# Altium project CutMonitor.PrjPcb
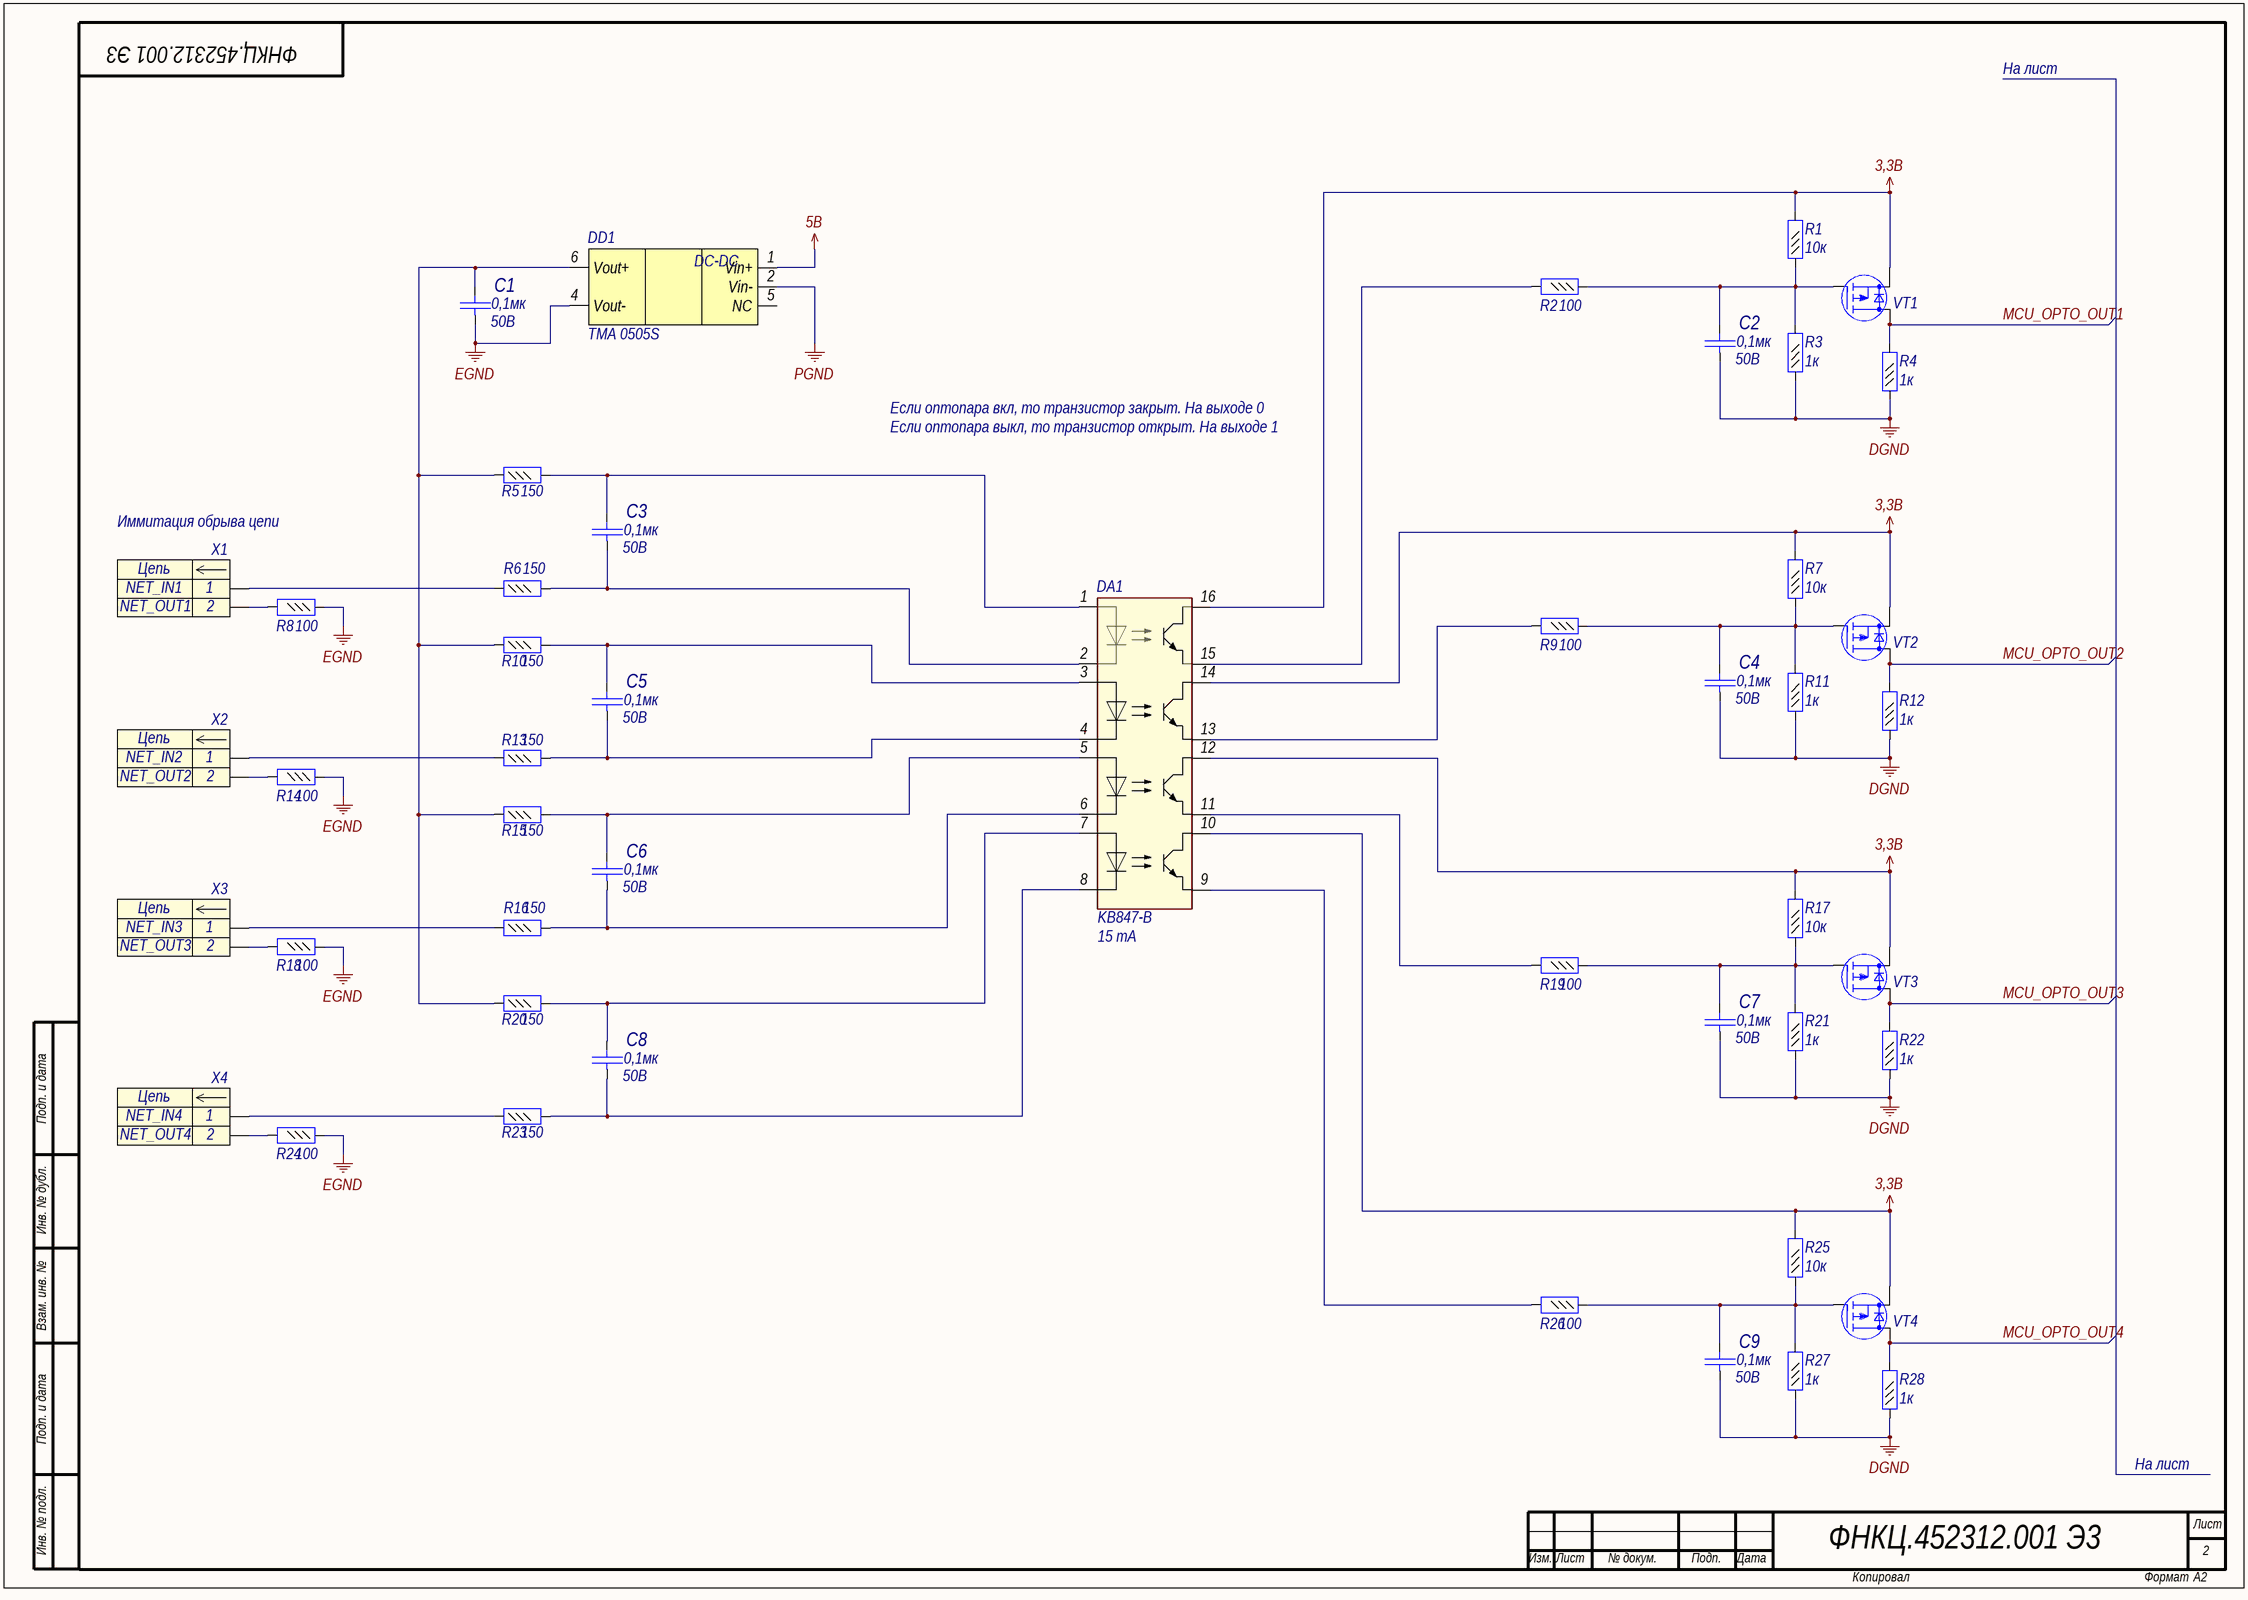
[diagram p0: CutMonitor_Opto.SchDoc]
5 sheets, 192 parts. Net scope: global (net labels, ports and power ports of the same name join across sheets).
Board file: CutMonitor.PcbDoc
Sheets:
  CutMonitor_Opto.SchDoc
  CutMonitor_MCU.SchDoc
  CutMonitor_Power.SchDoc
  CutMonitor_Motor.SchDoc
  CutMonitor_PressureSensor.SchDoc

## Sheet CutMonitor_Opto.SchDoc
size 594 x 420 mm; DocumentNumber: ФНКЦ.452312.001 Э3; SheetNumber: 2; Format: A2

### Parts
C1  value 0,1мк  Voltage: 50B  [C0603]  (hidden comment: Capacitor)
C2  value 0,1мк  Voltage: 50B  [C0603]  (hidden comment: Capacitor)
C3  value 0,1мк  Voltage: 50B  [C0603]  (hidden comment: Capacitor)
C4  value 0,1мк  Voltage: 50B  [C0603]  (hidden comment: Capacitor)
C5  value 0,1мк  Voltage: 50B  [C0603]  (hidden comment: Capacitor)
C6  value 0,1мк  Voltage: 50B  [C0603]  (hidden comment: Capacitor)
C7  value 0,1мк  Voltage: 50B  [C0603]  (hidden comment: Capacitor)
C8  value 0,1мк  Voltage: 50B  [C0603]  (hidden comment: Capacitor)
C9  value 0,1мк  Voltage: 50B  [C0603]  (hidden comment: Capacitor)
DA1  Part Number: KB847-B  [OPTO-16]  (hidden comment: OPTO-4)
DD1  Part Number: TMA 0505S  [TMH0505]  (hidden comment: TMA)
R1  value 10к  [R0603]  (hidden comment: Resistor_0,062Вт)
R2  value 100  [R0603]  (hidden comment: Resistor_0,062Вт)
R3  value 1к  [R0603]  (hidden comment: Resistor_0,062Вт)
R4  value 1к  [R0603]  (hidden comment: Resistor_0,062Вт)
R5  value 150  [R0603]  (hidden comment: Resistor_0,062Вт)
R6  value 150  [R0603]  (hidden comment: Resistor_0,062Вт)
R7  value 10к  [R0603]  (hidden comment: Resistor_0,062Вт)
R8  value 100  [R0603]  (hidden comment: Resistor_0,062Вт)
R9  value 100  [R0603]  (hidden comment: Resistor_0,062Вт)
R10  value 150  [R0603]  (hidden comment: Resistor_0,062Вт)
R11  value 1к  [R0603]  (hidden comment: Resistor_0,062Вт)
R12  value 1к  [R0603]  (hidden comment: Resistor_0,062Вт)
R13  value 150  [R0603]  (hidden comment: Resistor_0,062Вт)
R14  value 100  [R0603]  (hidden comment: Resistor_0,062Вт)
R15  value 150  [R0603]  (hidden comment: Resistor_0,062Вт)
R16  value 150  [R0603]  (hidden comment: Resistor_0,062Вт)
R17  value 10к  [R0603]  (hidden comment: Resistor_0,062Вт)
R18  value 100  [R0603]  (hidden comment: Resistor_0,062Вт)
R19  value 100  [R0603]  (hidden comment: Resistor_0,062Вт)
R20  value 150  [R0603]  (hidden comment: Resistor_0,062Вт)
R21  value 1к  [R0603]  (hidden comment: Resistor_0,062Вт)
R22  value 1к  [R0603]  (hidden comment: Resistor_0,062Вт)
R23  value 150  [R0603]  (hidden comment: Resistor_0,062Вт)
R24  value 100  [R0603]  (hidden comment: Resistor_0,062Вт)
R25  value 10к  [R0603]  (hidden comment: Resistor_0,062Вт)
R26  value 100  [R0603]  (hidden comment: Resistor_0,062Вт)
R27  value 1к  [R0603]  (hidden comment: Resistor_0,062Вт)
R28  value 1к  [R0603]  (hidden comment: Resistor_0,062Вт)
VT1  P-MOSFET  [SOT23-3]  (value not drawn)
VT2  P-MOSFET  [SOT23-3]  (value not drawn)
VT3  P-MOSFET  [SOT23-3]  (value not drawn)
VT4  P-MOSFET  [SOT23-3]  (value not drawn)
X1  (no value)  [JUMPER_2.54]
X2  (no value)  [JUMPER_2.54]
X3  (no value)  [JUMPER_2.54]
X4  (no value)  [JUMPER_2.54]

### Nets
3,3В: DA1.10 DA1.12 DA1.14 DA1.16 R1.2 R7.2 R17.2 R25.2 VT1.3(S) VT2.3(S) VT3.3(S) VT4.3(S)
5В: DD1.1(Vin+)
DGND: C2.1 C4.1 C7.1 C9.1 R3.1 R4.1 R11.1 R12.1 R21.1 R22.1 R27.1 R28.1
EGND: C1.1 DD1.4(Vout-) R8.1 R14.1 R18.1 R24.1
PGND: DD1.2(Vin-)
MCU_OPTO_OUT1: R4.2 VT1.2(D)
MCU_OPTO_OUT2: R12.2 VT2.2(D)
MCU_OPTO_OUT3: R22.2 VT3.2(D)
MCU_OPTO_OUT4: R28.2 VT4.2(D)
NetC1_2: C1.2 DD1.6(Vout+) R5.1 R10.1 R15.1 R20.1
NetC2_2: C2.2 R1.1 R2.1 R3.2 VT1.1(G)
NetC3_1: C3.1 DA1.2 R6.2
NetC3_2: C3.2 DA1.1 R5.2
NetC4_2: C4.2 R7.1 R9.1 R11.2 VT2.1(G)
NetC5_1: C5.1 DA1.4 R13.2
NetC5_2: C5.2 DA1.3 R10.2
NetC6_1: C6.1 DA1.6 R16.2
NetC6_2: C6.2 DA1.5 R15.2
NetC7_2: C7.2 R17.1 R19.1 R21.2 VT3.1(G)
NetC8_1: C8.1 DA1.8 R23.2
NetC8_2: C8.2 DA1.7 R20.2
NetC9_2: C9.2 R25.1 R26.1 R27.2 VT4.1(G)
NetDA1_9: DA1.9 R26.2
NetDA1_11: DA1.11 R19.2
NetDA1_13: DA1.13 R9.2
NetDA1_15: DA1.15 R2.2
NetR6_1: R6.1 X1.1
NetR8_2: R8.2 X1.2
NetR13_1: R13.1 X2.1
NetR14_2: R14.2 X2.2
NetR16_1: R16.1 X3.1
NetR18_2: R18.2 X3.2
NetR23_1: R23.1 X4.1
NetR24_2: R24.2 X4.2

Not connected (* = marked no-connect by the designer): DD1 5(NC)

### Notes on the sheet
- На лист
- Если оптопара вкл, то транзистор закрыт. На выходе 0
- Если оптопара выкл, то транзистор открыт. На выходе 1
- Иммитация обрыва цепи
- (near DA1) 15 mA
- Подп. и дата
- Инв. № дубл.
- Взам. инв. №
- Инв. № подл.
- Лист
- Изм.
- № докум.
- Подп.
- Дата
- Копировал
- Формат
- (in symbol connect54) Цепь
- (in symbol pwr22) DC-DC

### Library data of the parts
C1-C9 = cap131: Конденсатор; Part Name: Ceramic; Manufacture: Murata; Part Number: GRM188R71H104KA93D; id: cap131; TKE: X7R
DA1 = KB847-B: Опторазвязка х4; Manufacturer: Kingbright; id: opto1; Cut-off frequency: 80kHz; Forward Voltage: 1,2B
DD1 = pwr22: DC/DC преобразователь; Part Name: DC/DC Converter Isolated; Manufacturer: Traco Power; id: pwr22; Input Voltage: 5B; Current: 200mA; Type: Isolated; Output Voltage: 5B
R1 R7 R17 R25 = res483: Резистор; Manufacture: Yageo; Part Number: RC0603FR-0710KL; id: res483; Accuracy: 0,01; Part Name: Resistor; Power: 0,062Вт
R2 R8 R9 R14 R18 R19 R24 R26 = res435: Резистор; Manufacture: Yageo; Part Number: RC0603FR-07100RL; id: res435; Accuracy: 0,01; Part Name: Resistor; Power: 0,062Вт
R3 R4 R11 R12 R21 R22 R27 R28 = res459: Резистор; Manufacture: Yageo; Part Number: RC0603FR-071KL; id: res459; Accuracy: 0,01; Part Name: Resistor; Power: 0,062Вт
R5 R6 R10 R13 R15 R16 R20 R23 = res439: Резистор; Manufacture: Yageo; Part Number: RC0603FR-07150RL; id: res439; Accuracy: 0,01; Part Name: Resistor; Power: 0,062Вт
VT1-VT4 = mosfert5: N-MOSFET; Part Number: IRLML2244TRPbF; Manufacturer: International Rectifier; Structure: p-channel; V drain-source max: (-20B); Rds: 0,054Ohm; Gate-to-source voltage: (+-)12B; Continuous drain current: (-4,3)A; Total gate charge: 6,9nC; Pulsed drain current: (-18)A; Power dissipation: 1,3W; id: mosfert5
X1 = connect54: Разъем - 2 конт. вилка; Part Name: Jumper 2,54mm; Contact_1: NET_IN1; Contact_2: NET_OUT1; Etch: 2,54mm; id: connect54
X2 = connect54: Разъем - 2 конт. вилка; Part Name: Jumper 2,54mm; Contact_1: NET_IN2; Contact_2: NET_OUT2; Etch: 2,54mm; id: connect54
X3 = connect54: Разъем - 2 конт. вилка; Part Name: Jumper 2,54mm; Contact_1: NET_IN3; Contact_2: NET_OUT3; Etch: 2,54mm; id: connect54
X4 = connect54: Разъем - 2 конт. вилка; Part Name: Jumper 2,54mm; Contact_1: NET_IN4; Contact_2: NET_OUT4; Etch: 2,54mm; id: connect54

## Sheet CutMonitor_MCU.SchDoc
size 594 x 420 mm; DocumentNumber: ФНКЦ.452312.001 Э3; SheetNumber: 2; Format: A2
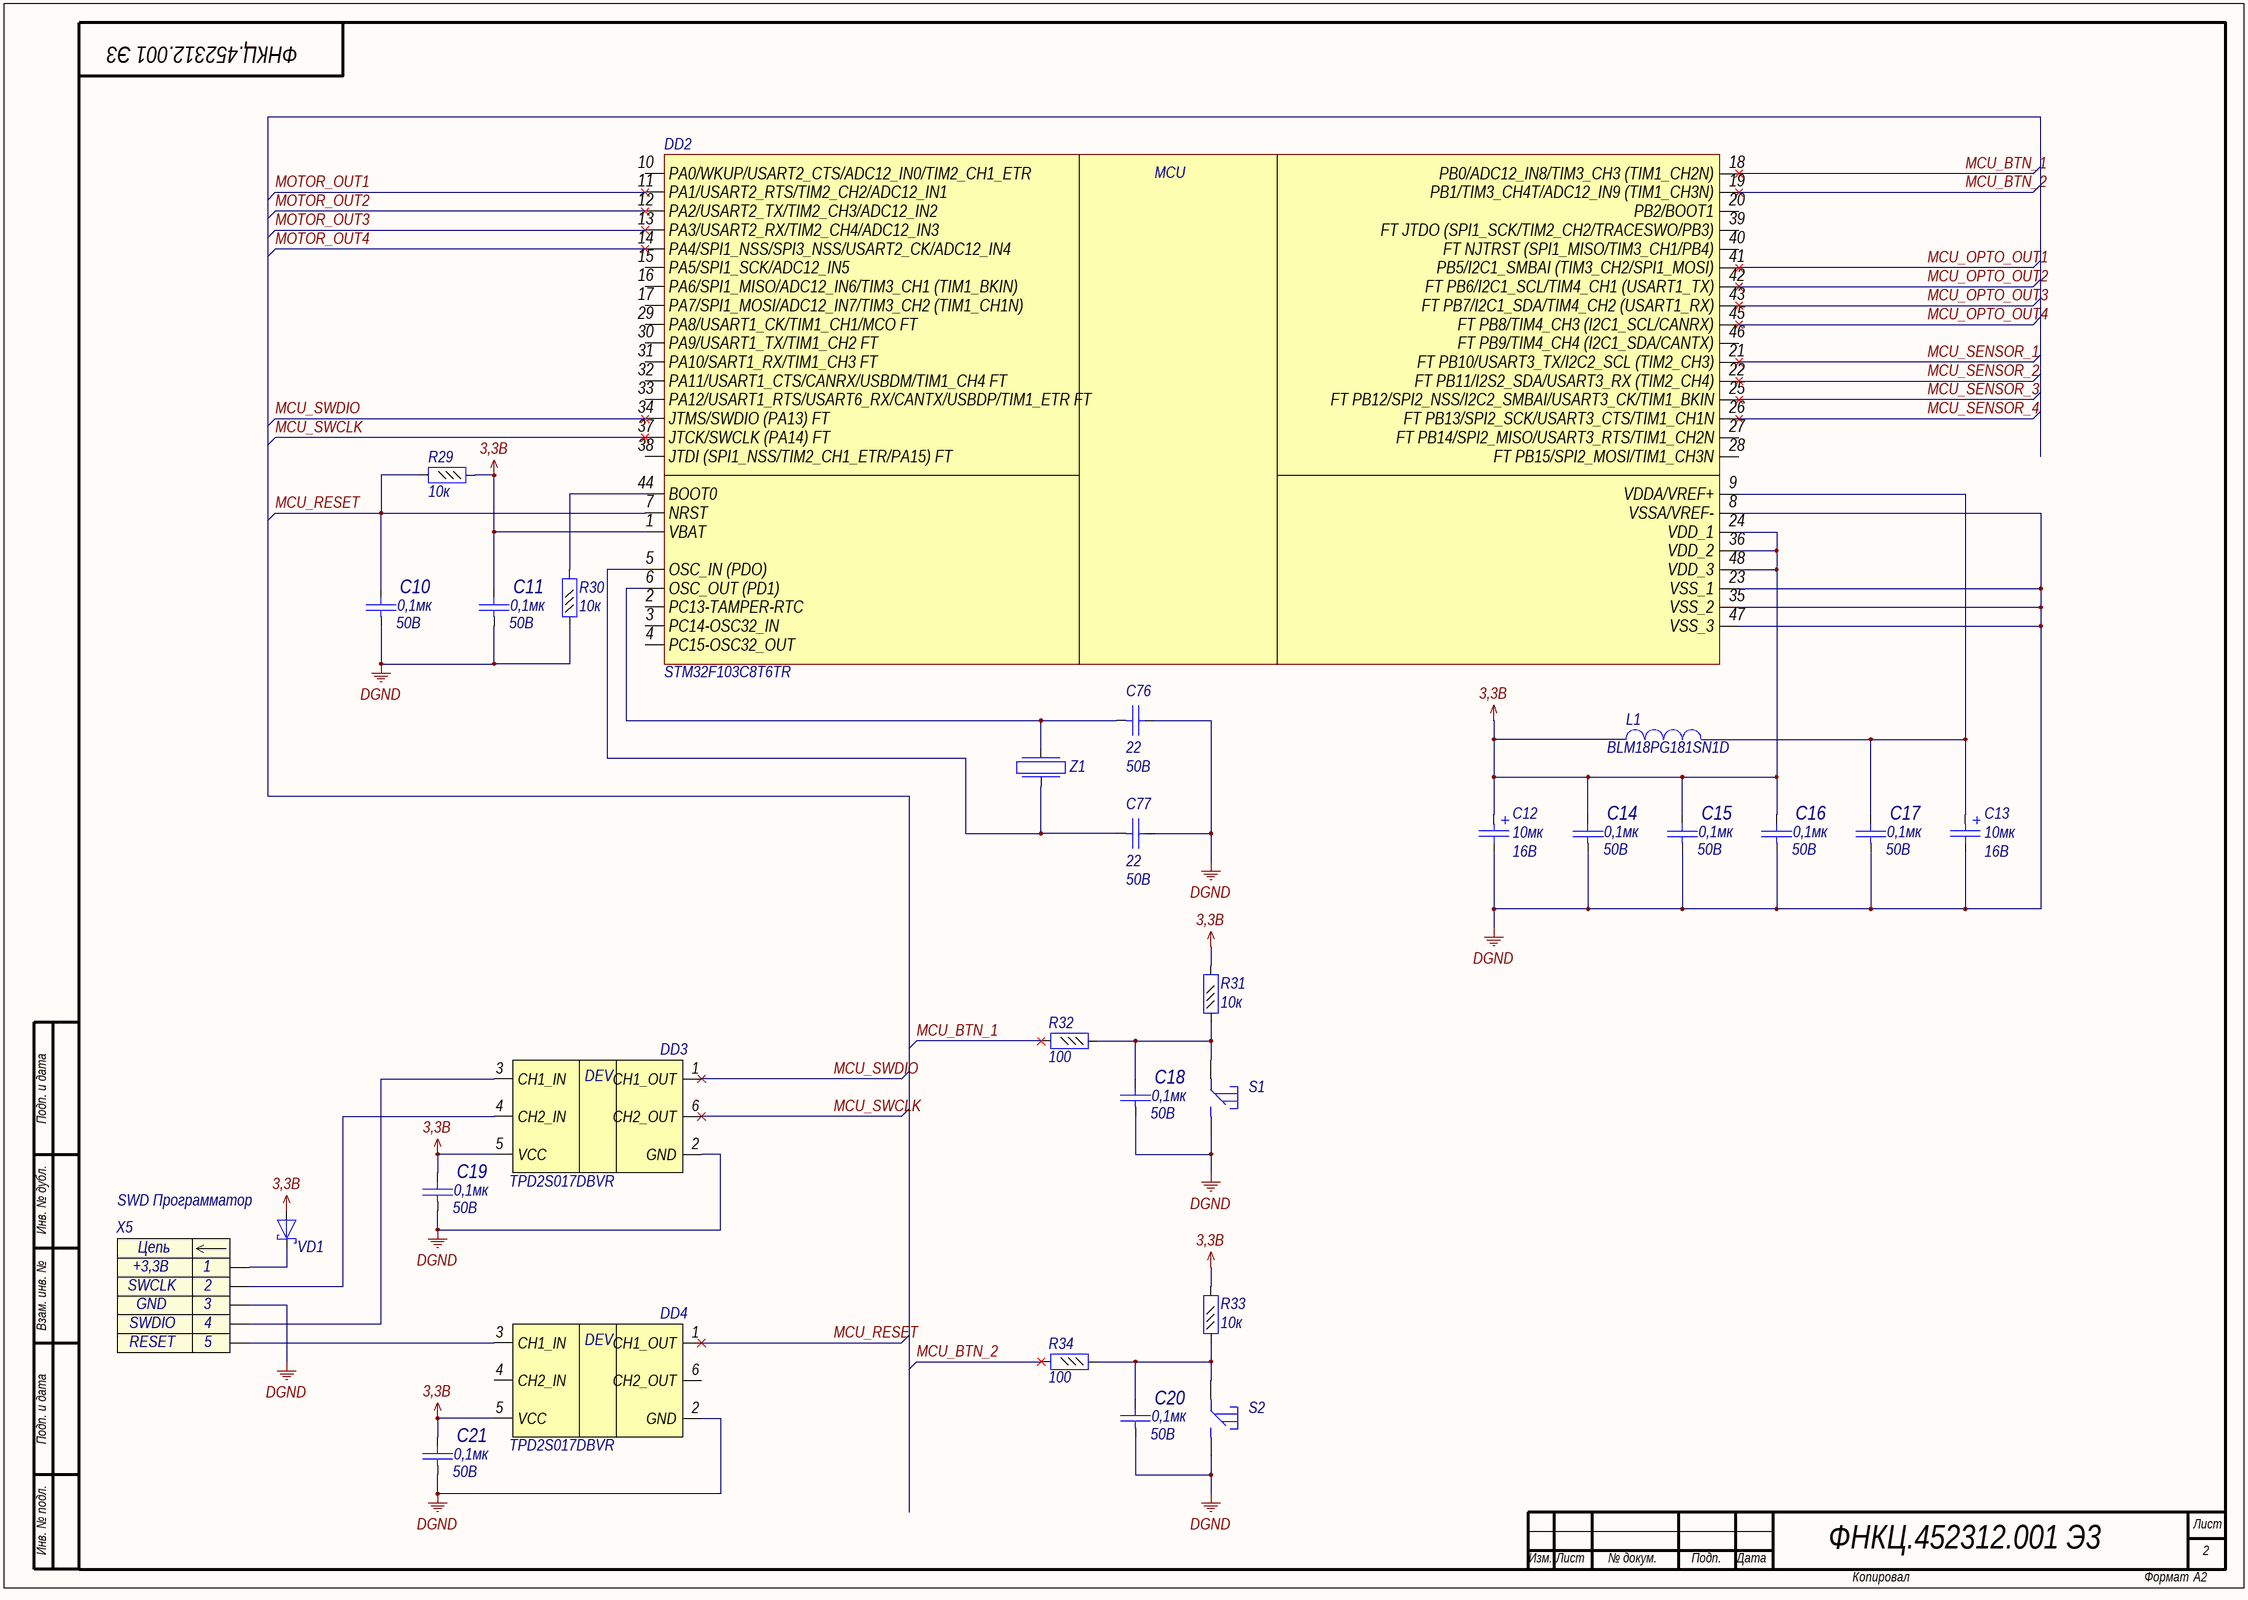
[diagram p1: CutMonitor_MCU.SchDoc]

### Parts
C10  value 0,1мк  Voltage: 50B  [C0603]  (hidden comment: Capacitor)
C11  value 0,1мк  Voltage: 50B  [C0603]  (hidden comment: Capacitor)
C12  value 10мк  Voltage: 16В  [TANTAL CASE A]  (hidden comment: Capacitor_pol)
C13  value 10мк  Voltage: 16В  [TANTAL CASE A]  (hidden comment: Capacitor_pol)
C14  value 0,1мк  Voltage: 50B  [C0603]  (hidden comment: Capacitor)
C15  value 0,1мк  Voltage: 50B  [C0603]  (hidden comment: Capacitor)
C16  value 0,1мк  Voltage: 50B  [C0603]  (hidden comment: Capacitor)
C17  value 0,1мк  Voltage: 50B  [C0603]  (hidden comment: Capacitor)
C18  value 0,1мк  Voltage: 50B  [C0603]  (hidden comment: Capacitor)
C19  value 0,1мк  Voltage: 50B  [C0603]  (hidden comment: Capacitor)
C20  value 0,1мк  Voltage: 50B  [C0603]  (hidden comment: Capacitor)
C21  value 0,1мк  Voltage: 50B  [C0603]  (hidden comment: Capacitor)
C76  value 22  Voltage: 50B  [C0603]  (hidden comment: Capacitor)
C77  value 22  Voltage: 50B  [C0603]  (hidden comment: Capacitor)
DD2  STM32F103C8T6TR  [LQFP48]
DD3  Part Number: TPD2S017DBVR  [SOT23-6]  (hidden comment: TPD2S017)
DD4  Part Number: TPD2S017DBVR  [SOT23-6]  (hidden comment: TPD2S017)
L1  Part Number: BLM18PG181SN1D  [L0603]  (hidden comment: Inductor)
R29  value 10к  [R0603]  (hidden comment: Resistor_0,062Вт)
R30  value 10к  [R0603]  (hidden comment: Resistor_0,062Вт)
R31  value 10к  [R0603]  (hidden comment: Resistor_0,062Вт)
R32  value 100  [R0603]  (hidden comment: Resistor_0,062Вт)
R33  value 10к  [R0603]  (hidden comment: Resistor_0,062Вт)
R34  value 100  [R0603]  (hidden comment: Resistor_0,062Вт)
S1  Button  [Button_SMD]  (value not drawn)
S2  Button  [Button_SMD]  (value not drawn)
VD1  DiodeSchottky  [SOD-523]  (value not drawn)
X5  SWD Программатор  [PLS-5]
Z1  Crystal  [QSMD5.0x3.2x1.0]  (value not drawn)

### Nets
3,3B: C11.2 C12.1 C14.2 C15.2 C16.2 C19.2 C21.2 DD2.1(VBAT) DD2.24(VDD_1) DD2.36(VDD_2) DD2.48(VDD_3) DD3.5(VCC) DD4.5(VCC) L1.1 R29.1 R31.2 R33.2 VD1.2(A)
DGND: C10.1 C11.1 C12.2 C13.2 C14.1 C15.1 C16.1 C17.1 C18.1 C19.1 C20.1 C21.1 C76.2 C77.2 DD2.8(VSSA/VREF-) DD2.23(VSS_1) DD2.35(VSS_2) DD2.47(VSS_3) DD3.2(GND) DD4.2(GND) R30.1 S1.4 S2.4 X5.3
MCU_BTN_1: DD2.18(PB0/ADC12_IN8/TIM3_CH3_(TIM1_CH2N)) R32.2
MCU_BTN_2: DD2.19(PB1/TIM3_CH4T/ADC12_IN9_(TIM1_CH3N)) R34.2
MCU_OPTO_OUT1: DD2.41(PB5/I2C1_SMBAI_(TIM3_CH2/SPI1_MOSI))
MCU_OPTO_OUT2: DD2.42(FT_PB6/I2C1_SCL/TIM4_CH1_(USART1_TX))
MCU_OPTO_OUT3: DD2.43(FT_PB7/I2C1_SDA/TIM4_CH2_(USART1_RX))
MCU_OPTO_OUT4: DD2.45(FT_PB8/TIM4_CH3_(I2C1_SCL/CANRX))
MCU_RESET: C10.2 DD2.7(NRST) DD4.1(CH1_OUT) R29.2
MCU_SENSOR_1: DD2.21(FT_PB10/USART3_TX/I2C2_SCL_(TIM2_CH3))
MCU_SENSOR_2: DD2.22(FT_PB11/I2S2_SDA/USART3_RX_(TIM2_CH4))
MCU_SENSOR_3: DD2.25(FT_PB12/SPI2_NSS/I2C2_SMBAI/USART3_CK/TIM1_BKIN)
MCU_SENSOR_4: DD2.26(FT_PB13/SPI2_SCK/USART3_CTS/TIM1_CH1N)
MCU_SWCLK: DD2.37(JTCK/SWCLK_(PA14)_FT) DD3.6(CH2_OUT)
MCU_SWDIO: DD2.34(JTMS/SWDIO_(PA13)_FT) DD3.1(CH1_OUT)
MOTOR_OUT1: DD2.11(PA1/USART2_RTS/TIM2_CH2/ADC12_IN1)
MOTOR_OUT2: DD2.12(PA2/USART2_TX/TIM2_CH3/ADC12_IN2)
MOTOR_OUT3: DD2.13(PA3/USART2_RX/TIM2_CH4/ADC12_IN3)
MOTOR_OUT4: DD2.14(PA4/SPI1_NSS/SPI3_NSS/USART2_CK/ADC12_IN4)
NetC13_1: C13.1 C17.2 DD2.9(VDDA/VREF+) L1.2
NetC18_2: C18.2 R31.1 R32.1 S1.1
NetC20_2: C20.2 R33.1 R34.1 S2.1
NetC76_1: C76.1 DD2.6(OSC_OUT_(PD1)) Z1.2
NetC77_1: C77.1 DD2.5(OSC_IN_(PDO)) Z1.1
NetDD2_44: DD2.44(BOOT0) R30.2
NetDD3_3: DD3.3(CH1_IN) X5.4
NetDD3_4: DD3.4(CH2_IN) X5.2
NetDD4_3: DD4.3(CH1_IN) X5.5
NetVD1_1: VD1.1(K) X5.1

Not connected (* = marked no-connect by the designer): DD2 2(PC13-TAMPER-RTC) 3(PC14-OSC32_IN) 4(PC15-OSC32_OUT) 10(PA0/WKUP/USART2_CTS/ADC12_IN0/TIM2_CH1_ETR) 15(PA5/SPI1_SCK/ADC12_IN5) 16(PA6/SPI1_MISO/ADC12_IN6/TIM3_CH1_(TIM1_BKIN)) 17(PA7/SPI1_MOSI/ADC12_IN7/TIM3_CH2_(TIM1_CH1N)) 20(PB2/BOOT1) 27(FT_PB14/SPI2_MISO/USART3_RTS/TIM1_CH2N) 28(FT_PB15/SPI2_MOSI/TIM1_CH3N) 29(PA8/USART1_CK/TIM1_CH1/MCO_FT) 30(PA9/USART1_TX/TIM1_CH2_FT) 31(PA10/SART1_RX/TIM1_CH3_FT) 32(PA11/USART1_CTS/CANRX/USBDM/TIM1_CH4_FT) 33(PA12/USART1_RTS/USART6_RX/CANTX/USBDP/TIM1_ETR_FT) 38(JTDI_(SPI1_NSS/TIM2_CH1_ETR/PA15)_FT) 39(FT_JTDO_(SPI1_SCK/TIM2_CH2/TRACESWO/PB3)) 40(FT_NJTRST_(SPI1_MISO/TIM3_CH1/PB4)) 46(FT_PB9/TIM4_CH4_(I2C1_SDA/CANTX)); DD4 4(CH2_IN) 6(CH2_OUT)

### Notes on the sheet
- Подп. и дата
- Инв. № дубл.
- Взам. инв. №
- Инв. № подл.
- Лист
- Изм.
- № докум.
- Подп.
- Дата
- Копировал
- Формат
- (in symbol connect6) Цепь
- (in symbol microcont0) MСU
- (in symbol TPD2S017DBVR) DEV

### Library data of the parts
C10 C11 C14-C21 = cap131: as C1 on sheet CutMonitor_Opto
C12 C13 = cap199: Конденсатор полярный; Part Name: Tantal; Manufacture: Vishay; Part Number: 293D106X9016A2TE3; id: cap199
C76 C77 = cap77: Конденсатор; Part Name: Ceramic; Manufacture: Yageo; Part Number: CC0603JRNPO9BN220; id: cap77; TKE: NP0
DD2 = microcont0: Medium-density performance line ARM®-based 32-bit MCU with 64  or 128 KB Flash, USB, CAN, 7 timers, 2 ADCs, 9 com. interfaces; Part Name: Microcontroller; Frequency: 72MHz; ADC: 10x12b; Interface: can, i2c, irda, lin, spi, uart, usb; Flash: 64kb; Pin in: 37; Power Supply: 2.0-3.6 V; id: microcont0; Part Number: STM32F103C8T6TR
DD3 DD4 = TPD2S017DBVR: EMI Filter; Part Name: ESD Suppressors; Manufacture: Texas Instruments; id: esd4; Max Reverse Voltage: 12B; Capacitance: 1pF; Number of Channels: 2
L1 = ind0: EMI Suppression Filter; Part Name: EMI Suppression Filters; Rated Current: 1,5A; id: ind0; Resistance: 0,09Ohm
R29-R31 R33 = res483: as R1 on sheet CutMonitor_Opto; Part Name: Resistor; Power: 0,062Вт
R32 R34 = res435: as R2 on sheet CutMonitor_Opto; Part Name: Resistor; Power: 0,062Вт
S1 S2 = btn4: Кнопка; Part Name: Button 5mm; id: btn4
VD1 = diode12: Диод Шоттки; Part Number: PMEG2010AEB.115; Manufacture: NXP Semiconductor; Max Reverse Voltage: 20B; Forward Voltage: 0,62B; Forward Current: 1А; Breakdown Current: 600uA; Capacitance: 25pF; Number of Channels: 1; id: diode12; Part Name: Diode Schottky
X5 = connect6: Разъем - 5 конт. вилка; Part Number: DS1021-1*5SF112-B; Manufacture: Ningbo connfly electronic; Contact_1: +3,3B; Contact_2: SWCLK; Contact_3: GND; Contact_4: SWDIO; Contact_5: RESET; Etch: 2,54mm; Part Name: PLS-5; id: connect6
Z1 = crystal0: Кварцевый резонатор; Manufacture: GEYER; Part Number: KX-9A; Frequence: 8MHz; id: crystal0

## Sheet CutMonitor_Power.SchDoc: Аудиопередатчик
size 420 x 297 mm; ApprovedBy: Чукалкин; CheckedBy: Суворов; DrawnBy: Подлесный; DocumentNumber: ФНКЦ.542321.001 Э3; SheetNumber: 1; SheetTotal: 5; DocumentType: Схема электрическая принципиальная; Format: A3; ImagePath: ФНКЦ.542321.001
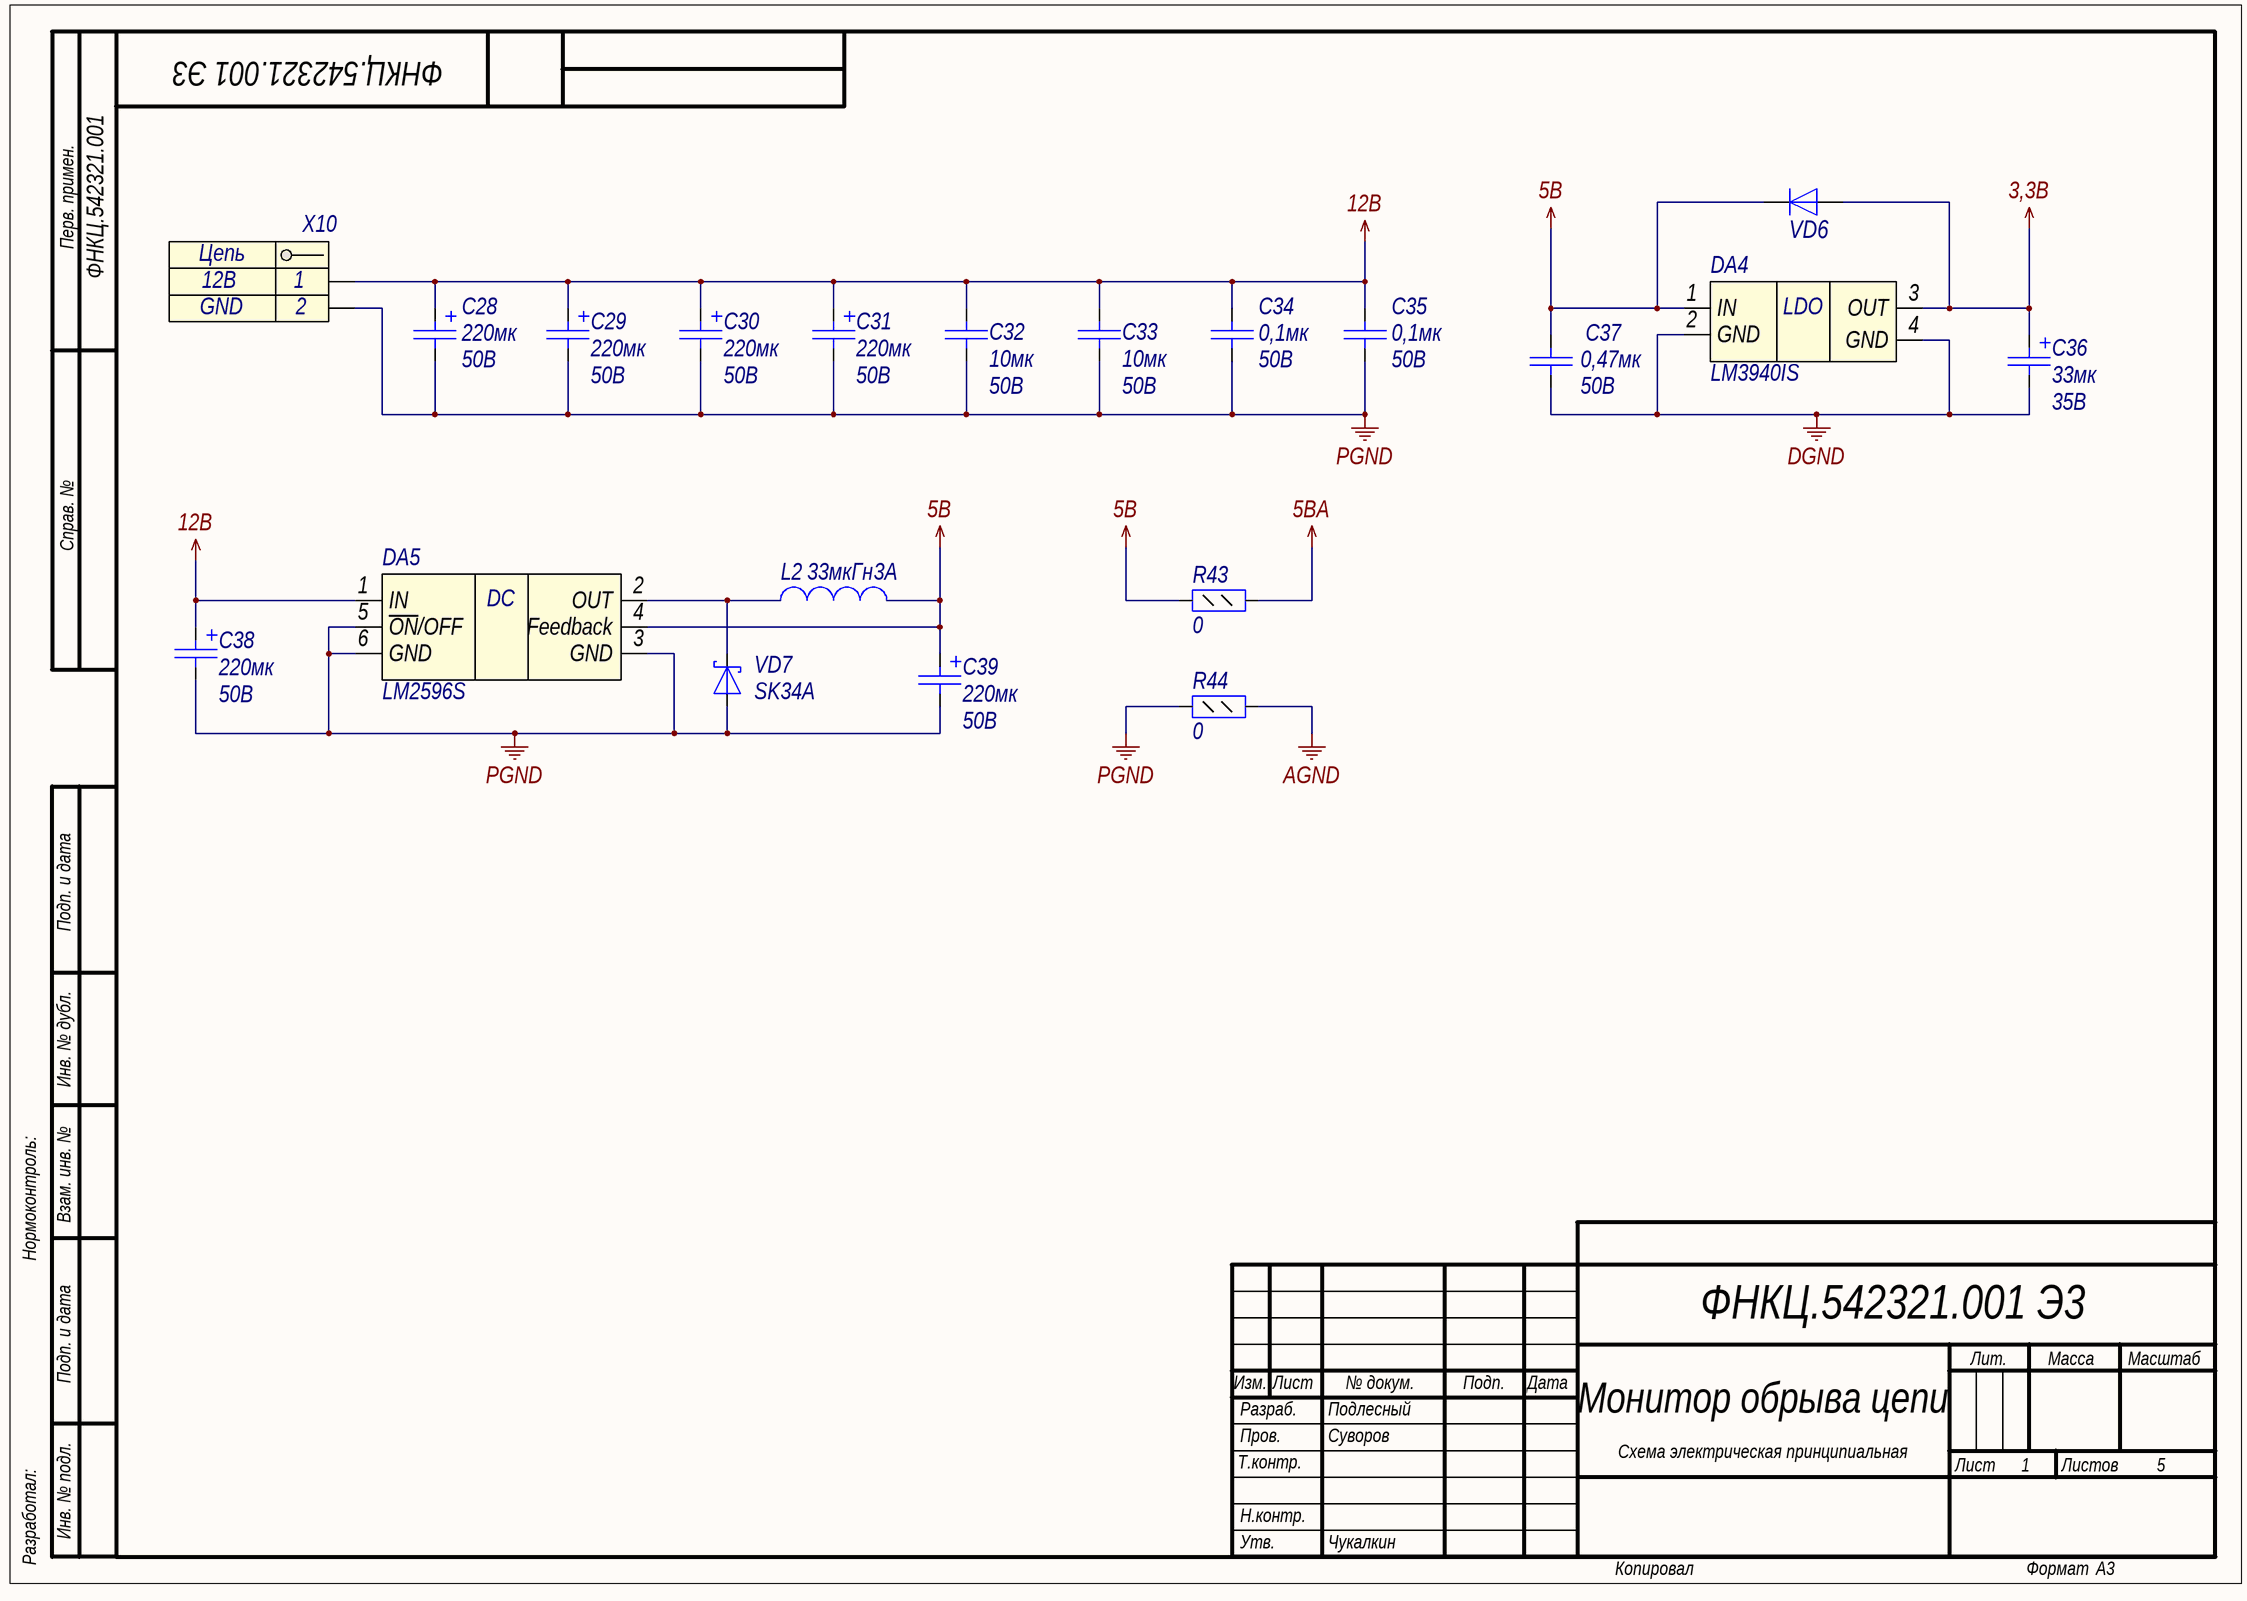
[diagram p2: CutMonitor_Power.SchDoc]

### Parts
C28  value 220мк  Voltage: 50В  [K50-35(10X12.5)]  (hidden comment: Capacitor_pol)
C29  value 220мк  Voltage: 50В  [K50-35(10X12.5)]  (hidden comment: Capacitor_pol)
C30  value 220мк  Voltage: 50В  [K50-35(10X12.5)_MIRROR]  (hidden comment: Capacitor_pol)
C31  value 220мк  Voltage: 50В  [K50-35(10X12.5)_MIRROR]  (hidden comment: Capacitor_pol)
C32  value 10мк  Voltage: 50В  [C1210]  (hidden comment: Capacitor)
C33  value 10мк  Voltage: 50В  [C1210]  (hidden comment: Capacitor)
C34  value 0,1мк  Voltage: 50В  [C1206]  (hidden comment: Capacitor)
C35  value 0,1мк  Voltage: 50В  [C1206]  (hidden comment: Capacitor)
C36  value 33мк  Voltage: 35В  [TANTAL CASE D]  (hidden comment: Capacitor_pol)
C37  value 0,47мк  Voltage: 50В  [C1206]  (hidden comment: Capacitor)
C38  value 220мк  Voltage: 50В  [K50-35(10X12.5)_MIRROR]  (hidden comment: Capacitor_pol)
C39  value 220мк  Voltage: 50В  [K50-35(10X12.5)_MIRROR]  (hidden comment: Capacitor_pol)
DA4  LM3940IS  [TO-263-3]
DA5  LM2596S  [TO-263-5]
L2  value 33мкГн  Rated Current: 3A  [IND_12.8x12.8]  (hidden comment: Inductor)
R43  value 0  [R0805]  (hidden comment: Resistor_0,125Вт)
R44  value 0  [R0805]  (hidden comment: Resistor_0,125Вт)
VD6  Diode  [SOD-523]  (value not drawn)
VD7  Part Number: SK34A  [SMA]  (hidden comment: DiodeSchottky)
X10  Header_2_trm  [TERMINAL-2WAY-5MM]  (value not drawn)

### Nets
3,3B: C36.1 DA4.3(OUT) VD6.2(A)
5B: C37.2 C39.1 DA4.1(IN) DA5.4(Feedback) L2.2 R43.1 VD6.1(K)
5BA: R43.2
12B: C28.1 C29.1 C30.1 C31.1 C32.1 C33.1 C34.1 C35.1 C38.1 DA5.1(IN) X10.1
AGND: R44.2
DGND: C36.2 C37.1 DA4.2(GND) DA4.4(GND)
PGND: C28.2 C29.2 C30.2 C31.2 C32.2 C33.2 C34.2 C35.2 C38.2 C39.2 DA5.3(GND) DA5.5(~{ON}/OFF) DA5.6(GND) R44.1 VD7.2(A) X10.2
NetDA5_2: DA5.2(OUT) L2.1 VD7.1(K)

### Notes on the sheet
- Перв. примен.
- Справ. №
- Подп. и дата
- Инв. № дубл.
- Нормоконтроль:
- Взам. инв. №
- Изм.
- Лист
- № докум.
- Подп.
- Дата
- Лит.
- Масса
- Масштаб
- Т.контр.
- Пров.
- Разраб.
- Монитор обрыва цепи
- Листов
- Разработал:
- Инв. № подл.
- Н.контр.
- Утв.
- Копировал
- Формат
- (in symbol connect21) Цепь
- (in symbol pwr0) LDO
- (in symbol pwr3) DC

### Library data of the parts
C28 C29 = cap219: Конденсатор полярный; Part Name: Electrolit; Manufacture: Jamicon; Part Number: TKR221M1HG13; id: cap219; tga: 0.20%
C30 C31 C38 C39 = cap220: Конденсатор полярный; Part Name: Electrolit; Manufacture: Jamicon; Part Number: TKR221M1HG13; id: cap220; tga: 0.20%
C32 C33 = cap206: Конденсатор; Part Name: Ceramic; Manufacture: Murata; Part Number: GRM32ER71H106K; id: cap206; TKE: X7R
C34 C35 = cap180: Конденсатор; Part Name: Ceramic; Manufacture: Murata; Part Number: GRM319R71H104K**; id: cap180; TKE: X7R
C36 = cap260: Конденсатор полярный; Part Name: Tantal; Manufacture: AVX; Part Number: TAJD336K035RNJ; id: cap260
C37 = cap183: Конденсатор; Part Name: Ceramic; Manufacture: Murata; Part Number: GRM31MR71H474K; id: cap183; TKE: X7R
DA4 = pwr0: Low-Dropout Regulator for 5-V to 3.3-V Conversion; Part Name: Regulator for 5V to 3.3V Conversion; Part Number: LM3940IS-3.3/NOPB; Manufacturer: Texas Instruments; id: pwr0; Input Voltage: 5B; Output Voltage: 3,3B; Dropout Voltage: 200mV,1V; Current: 1A; Type: Linear
DA5 = pwr3: 3-A Step-Down Voltage Regulator; Part Name: 3A Step-Down Voltage Regulator; Part Number: LM2596S-5.0/NOPB; Manufacturer: Texas Instruments; id: pwr3; Input Voltage: 40B; Output Voltage: 5B; Current: 3A; Type: Impulse
L2 = ind80: EMI Suppression Filter; Part Name: SMD Power Inductors; Part Number: B82477G4333M000; Manufacture: Epcos; id: ind80; Saturation Current: 3,5A; Resistance: 0,053Ohm
R43 R44 = res0: Резистор; Manufacture: Yageo; Part Number: RC0805FR-070RL; id: res0; Accuracy: 0,01; Part Name: Resistor; Power: 0,125Вт
VD6 = diode3: Диод; Part Number: BAS516.135; Manufacture: Nexperia; id: diode3; Max Reverse Voltage: 100B; Forward Voltage: 1B; Leakage current: 0,5uA; Reverse Recovery time: 4ns; Capacitance: 1,5pF; Part Name: Diode
VD7 = diode1: Диод Шоттки; Manufacture: Taiwan Semiconductor; id: diode1; Max Reverse Voltage: 40B; Forward Voltage: 0,55B; Forward Current: 3A; Part Name: Diode Schottky
X10 = connect21: Разъем - 2 конт. клеммник; Part Name: TERMINAL BLOCK 2 way; Contact_1: 12B; Contact_2: GND; Etch: 5mm; id: connect21

## Sheet CutMonitor_Motor.SchDoc
size 594 x 420 mm; DocumentNumber: ФНКЦ.452312.001 Э3; SheetNumber: 2; Format: A2
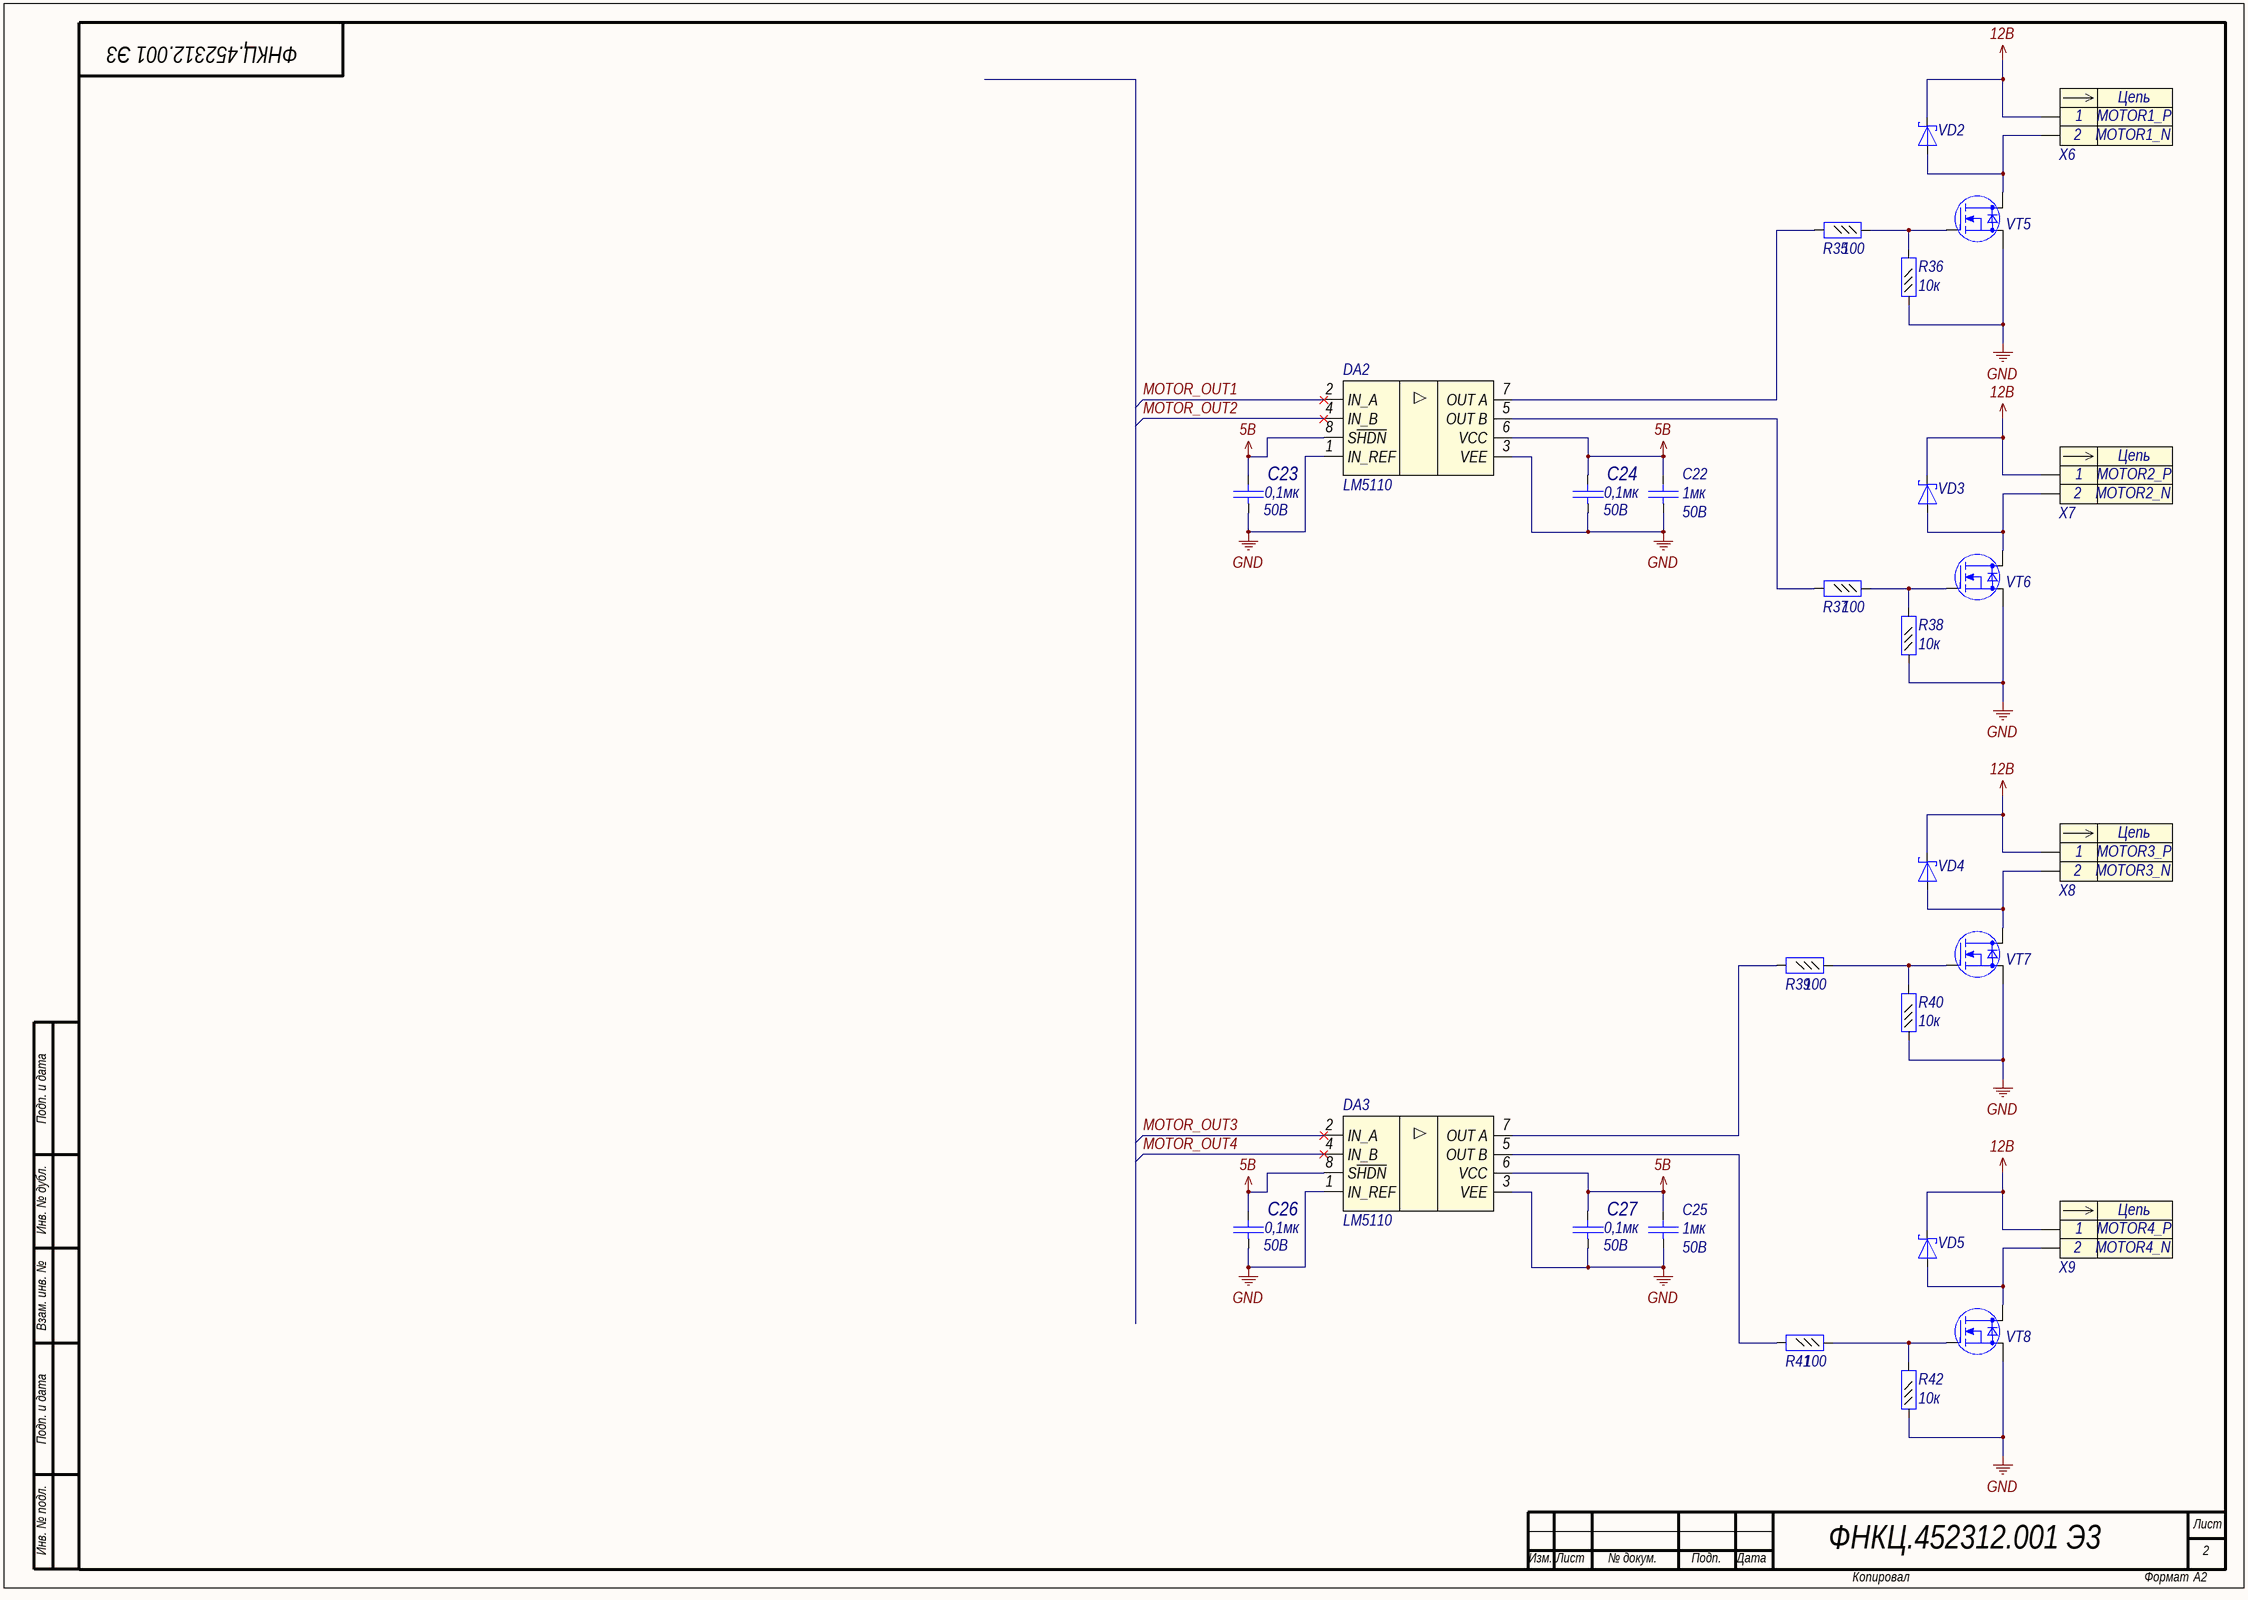
[diagram p3: CutMonitor_Motor.SchDoc]

### Parts
C22  value 1мк  Voltage: 50B  [C0805]  (hidden comment: Capacitor)
C23  value 0,1мк  Voltage: 50B  [C0603]  (hidden comment: Capacitor)
C24  value 0,1мк  Voltage: 50B  [C0603]  (hidden comment: Capacitor)
C25  value 1мк  Voltage: 50B  [C0805]  (hidden comment: Capacitor)
C26  value 0,1мк  Voltage: 50B  [C0603]  (hidden comment: Capacitor)
C27  value 0,1мк  Voltage: 50B  [C0603]  (hidden comment: Capacitor)
DA2  LM5110  [SO8]
DA3  LM5110  [SO8]
R35  value 100  [R0603]  (hidden comment: Resistor_0,062Вт)
R36  value 10к  [R0603]  (hidden comment: Resistor_0,062Вт)
R37  value 100  [R0603]  (hidden comment: Resistor_0,062Вт)
R38  value 10к  [R0603]  (hidden comment: Resistor_0,062Вт)
R39  value 100  [R0603]  (hidden comment: Resistor_0,062Вт)
R40  value 10к  [R0603]  (hidden comment: Resistor_0,062Вт)
R41  value 100  [R0603]  (hidden comment: Resistor_0,062Вт)
R42  value 10к  [R0603]  (hidden comment: Resistor_0,062Вт)
VD2  DiodeSchottky  [SOD-323]  (value not drawn)
VD3  DiodeSchottky  [SOD-323]  (value not drawn)
VD4  DiodeSchottky  [SOD-323]  (value not drawn)
VD5  DiodeSchottky  [SOD-323]  (value not drawn)
VT5  N-MOSFET  [DPAK]  (value not drawn)
VT6  N-MOSFET  [DPAK]  (value not drawn)
VT7  N-MOSFET  [DPAK]  (value not drawn)
VT8  N-MOSFET  [DPAK]  (value not drawn)
X6  (no value)  [JUMPER_2.54]
X7  (no value)  [JUMPER_2.54]
X8  (no value)  [JUMPER_2.54]
X9  (no value)  [JUMPER_2.54]

### Nets
5В: C22.2 C23.2 C24.2 C25.2 C26.2 C27.2 DA2.6(VCC) DA2.8(S~{HDN}) DA3.6(VCC) DA3.8(S~{HDN})
12B: VD2.1(K) VD3.1(K) VD4.1(K) VD5.1(K) X6.1 X7.1 X8.1 X9.1
GND: C22.1 C23.1 C24.1 C25.1 C26.1 C27.1 DA2.1(IN_REF) DA2.3(VEE) DA3.1(IN_REF) DA3.3(VEE) R36.1 R38.1 R40.1 R42.1 VT5.3(S) VT6.3(S) VT7.3(S) VT8.3(S)
MOTOR_OUT1: DA2.2(IN_A)
MOTOR_OUT2: DA2.4(IN_B)
MOTOR_OUT3: DA3.2(IN_A)
MOTOR_OUT4: DA3.4(IN_B)
NetDA2_5: DA2.5(OUT_B) R37.2
NetDA2_7: DA2.7(OUT_A) R35.2
NetDA3_5: DA3.5(OUT_B) R41.2
NetDA3_7: DA3.7(OUT_A) R39.2
NetR35_1: R35.1 R36.2 VT5.1(G)
NetR37_1: R37.1 R38.2 VT6.1(G)
NetR39_1: R39.1 R40.2 VT7.1(G)
NetR41_1: R41.1 R42.2 VT8.1(G)
NetVD2_2: VD2.2(A) VT5.2(D) X6.2
NetVD3_2: VD3.2(A) VT6.2(D) X7.2
NetVD4_2: VD4.2(A) VT7.2(D) X8.2
NetVD5_2: VD5.2(A) VT8.2(D) X9.2

### Notes on the sheet
- Подп. и дата
- Инв. № дубл.
- Взам. инв. №
- Инв. № подл.
- Лист
- Изм.
- № докум.
- Подп.
- Дата
- Копировал
- Формат
- (in symbol connect54) Цепь

### Library data of the parts
C22 C25 = cap151: Конденсатор; Part Name: Ceramic; Manufacture: Murata; Part Number: GRM21BR71H105K; id: cap151; TKE: X7R
C23 C24 C26 C27 = cap131: as C1 on sheet CutMonitor_Opto
DA2 DA3 = driver15: Driver 5A 2-OUT Low Side Inv/Non-Inv; Part Name: Dual 5-A Compound Gate Driver; Manufacture: Texas Instruments; Part Number: LM5110-1M; Logic High: 2,2В; Logic Low: 0,8B; Operating Supply Voltage: 3,5-14B; Min Operating Supply Voltage: (-)0,3B; Max Operating Supply Voltage: 15B; “A” OUTPUT: Noninverting; id: driver15; “B” OUTPUT: Noninverting; Maximum output current: 5A
R35 R37 R39 R41 = res435: as R2 on sheet CutMonitor_Opto; Part Name: Resistor; Power: 0,062Вт
R36 R38 R40 R42 = res483: as R1 on sheet CutMonitor_Opto; Part Name: Resistor; Power: 0,062Вт
VD2-VD5 = diode19: Диод Шоттки; Part Number: PMEG4010BEA.115; Manufacture: NXP Semiconductor; Max Reverse Voltage: 40B; Forward Voltage: 0,64B; Forward Current: 10mA; Capacitance: 50pF; Number of Channels: 1; id: diode19; Part Name: Diode Schottky
VT5-VT8 = mosfert9: Part Number: IRLR2905ZPBF; Manufacturer: International Rectifier; Structure: n-channel; V drain-source max: 55B; Rds: 0,0135Ohm; Gate-to-source voltage: (+-)16B; Continuous drain current: 60A; Total gate charge: 23nC; Pulsed drain current: 240A; Power dissipation: 110W; id: mosfert9
X6 = connect54: Разъем - 2 конт. вилка; Part Name: Jumper 2,54mm; Contact_1: MOTOR1_P; Contact_2: MOTOR1_N; Etch: 2,54mm; id: connect54
X7 = connect54: Разъем - 2 конт. вилка; Part Name: Jumper 2,54mm; Contact_1: MOTOR2_P; Contact_2: MOTOR2_N; Etch: 2,54mm; id: connect54
X8 = connect54: Разъем - 2 конт. вилка; Part Name: Jumper 2,54mm; Contact_1: MOTOR3_P; Contact_2: MOTOR3_N; Etch: 2,54mm; id: connect54
X9 = connect54: Разъем - 2 конт. вилка; Part Name: Jumper 2,54mm; Contact_1: MOTOR4_P; Contact_2: MOTOR4_N; Etch: 2,54mm; id: connect54

## Sheet CutMonitor_PressureSensor.SchDoc
size 594 x 420 mm; DocumentNumber: ФНКЦ.452312.001 Э3; SheetNumber: 2; Format: A2
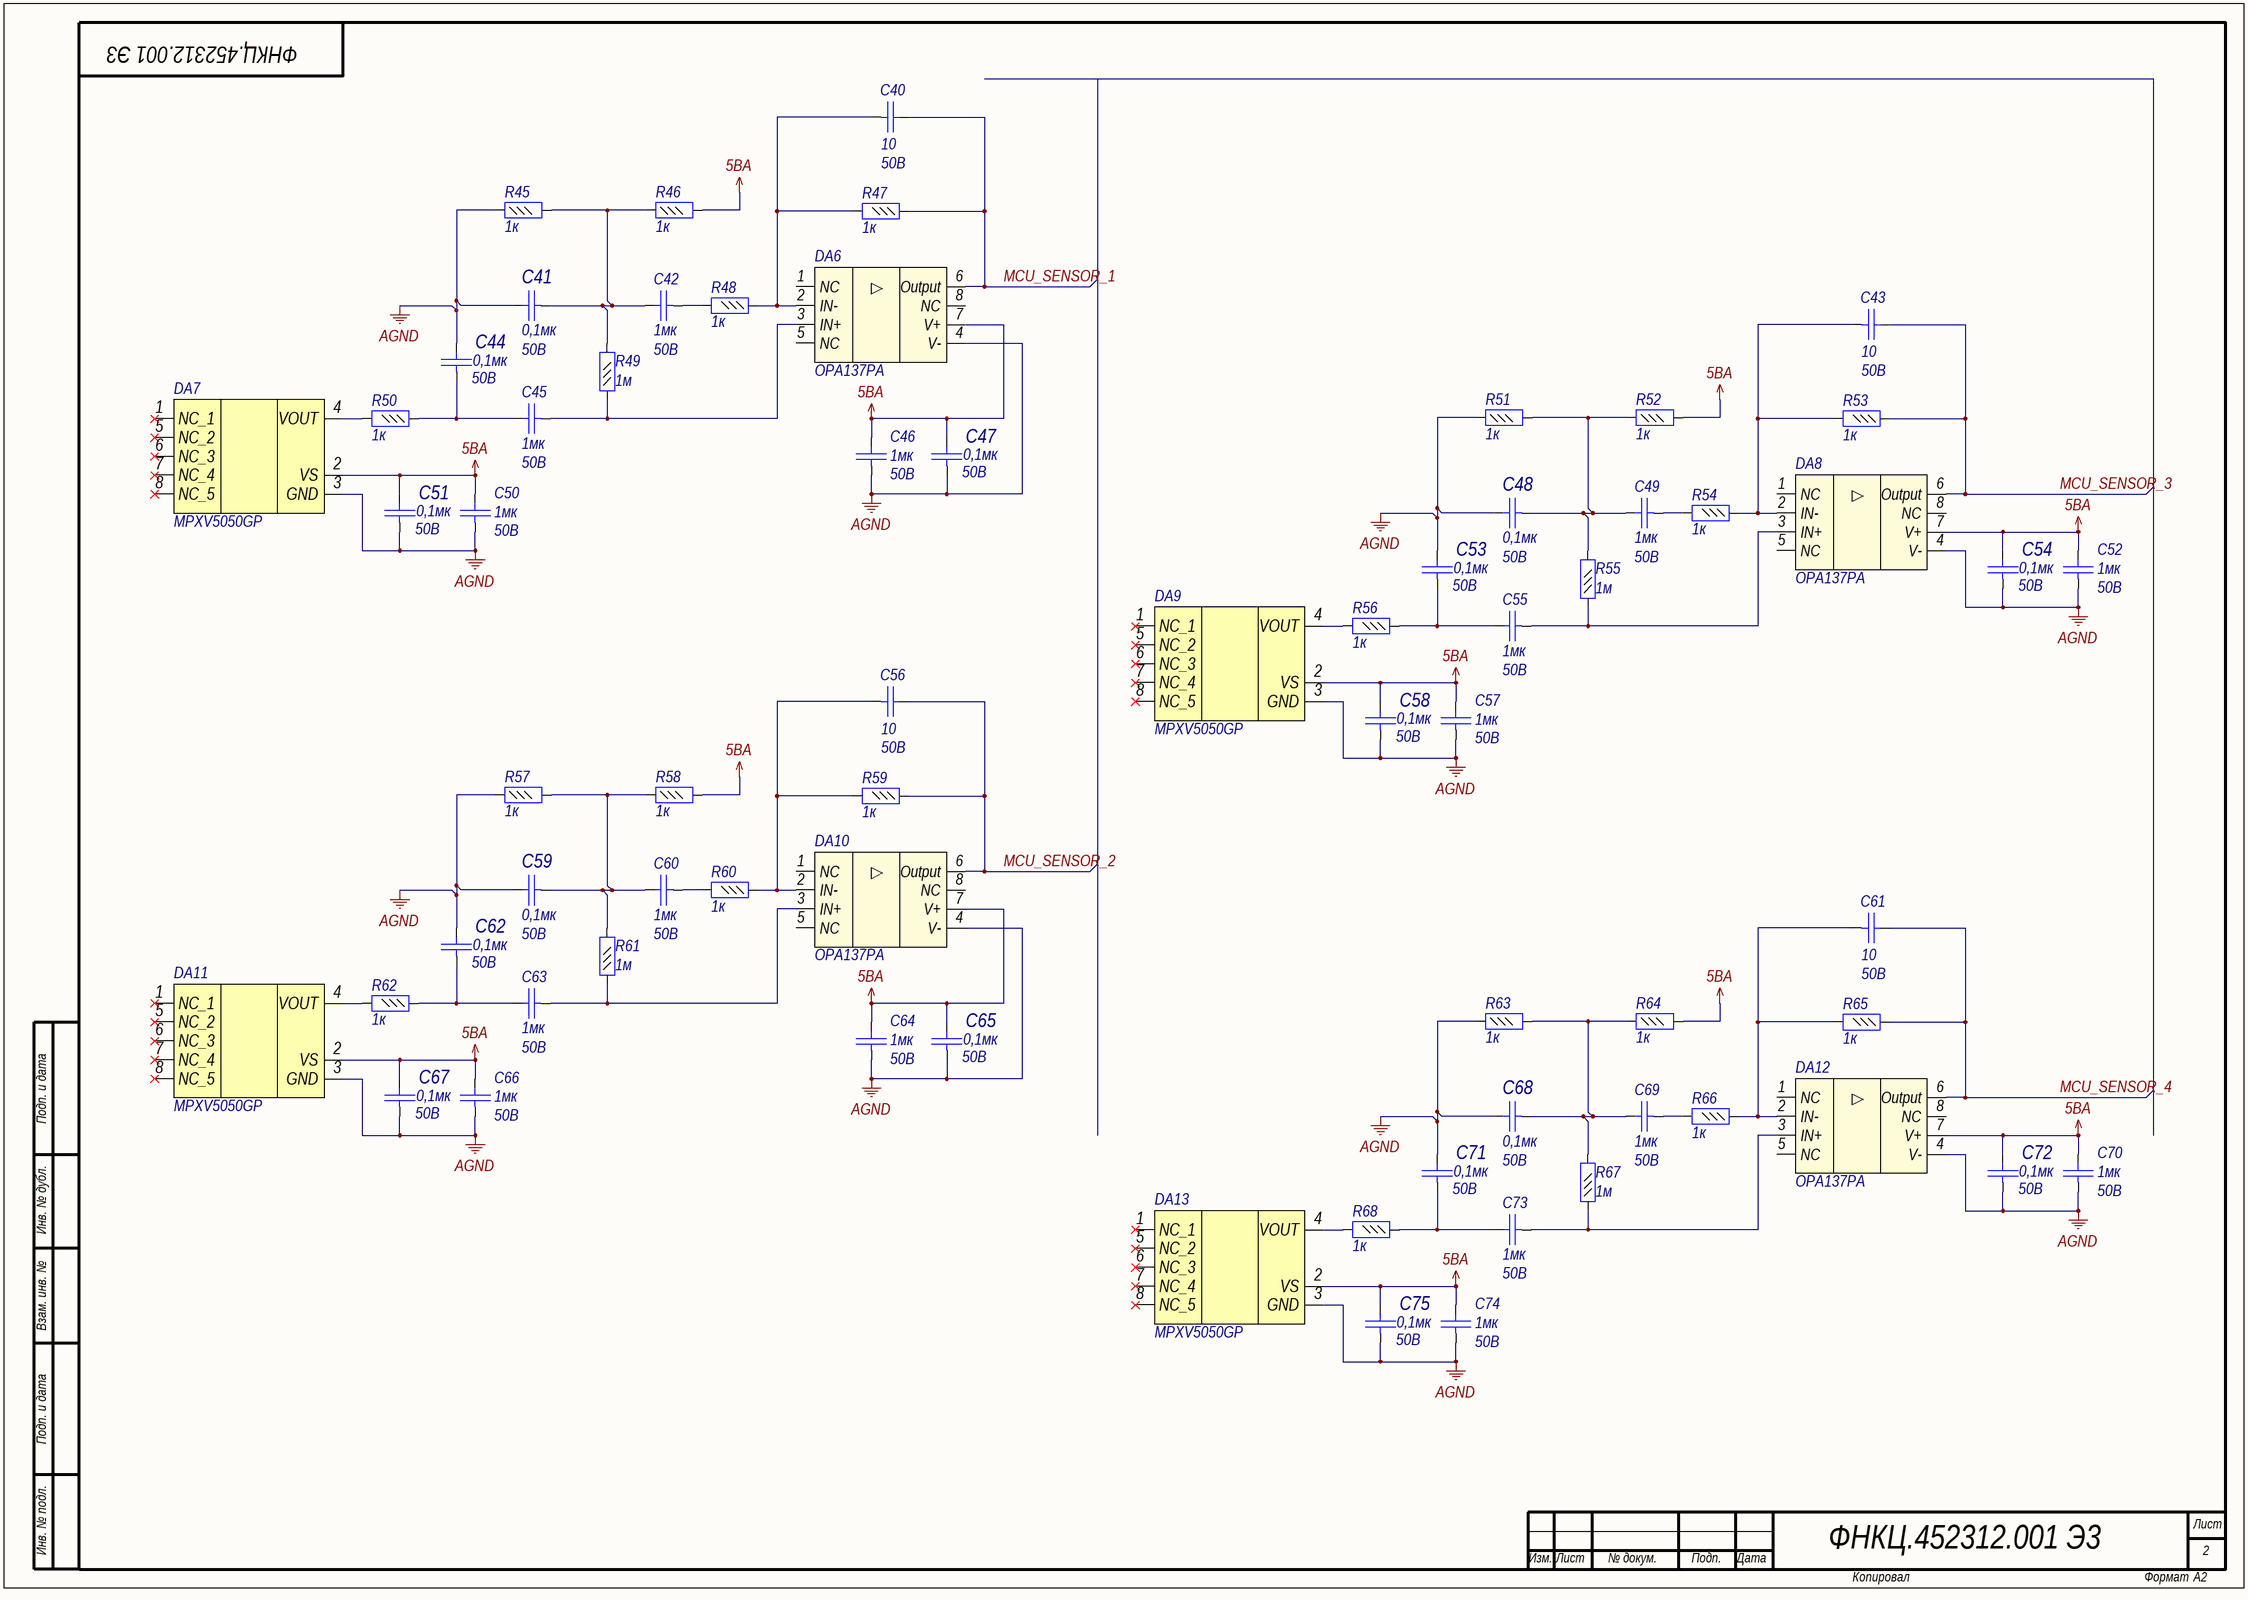
[diagram p4: CutMonitor_PressureSensor.SchDoc]

### Parts
C40  value 10  Voltage: 50B  [C0603]  (hidden comment: Capacitor)
C41  value 0,1мк  Voltage: 50B  [C0603]  (hidden comment: Capacitor)
C42  value 1мк  Voltage: 50B  [C0805]  (hidden comment: Capacitor)
C43  value 10  Voltage: 50B  [C0603]  (hidden comment: Capacitor)
C44  value 0,1мк  Voltage: 50B  [C0603]  (hidden comment: Capacitor)
C45  value 1мк  Voltage: 50B  [C0805]  (hidden comment: Capacitor)
C46  value 1мк  Voltage: 50B  [C0805]  (hidden comment: Capacitor)
C47  value 0,1мк  Voltage: 50B  [C0603]  (hidden comment: Capacitor)
C48  value 0,1мк  Voltage: 50B  [C0603]  (hidden comment: Capacitor)
C49  value 1мк  Voltage: 50B  [C0805]  (hidden comment: Capacitor)
C50  value 1мк  Voltage: 50B  [C0805]  (hidden comment: Capacitor)
C51  value 0,1мк  Voltage: 50B  [C0603]  (hidden comment: Capacitor)
C52  value 1мк  Voltage: 50B  [C0805]  (hidden comment: Capacitor)
C53  value 0,1мк  Voltage: 50B  [C0603]  (hidden comment: Capacitor)
C54  value 0,1мк  Voltage: 50B  [C0603]  (hidden comment: Capacitor)
C55  value 1мк  Voltage: 50B  [C0805]  (hidden comment: Capacitor)
C56  value 10  Voltage: 50B  [C0603]  (hidden comment: Capacitor)
C57  value 1мк  Voltage: 50B  [C0805]  (hidden comment: Capacitor)
C58  value 0,1мк  Voltage: 50B  [C0603]  (hidden comment: Capacitor)
C59  value 0,1мк  Voltage: 50B  [C0603]  (hidden comment: Capacitor)
C60  value 1мк  Voltage: 50B  [C0805]  (hidden comment: Capacitor)
C61  value 10  Voltage: 50B  [C0603]  (hidden comment: Capacitor)
C62  value 0,1мк  Voltage: 50B  [C0603]  (hidden comment: Capacitor)
C63  value 1мк  Voltage: 50B  [C0805]  (hidden comment: Capacitor)
C64  value 1мк  Voltage: 50B  [C0805]  (hidden comment: Capacitor)
C65  value 0,1мк  Voltage: 50B  [C0603]  (hidden comment: Capacitor)
C66  value 1мк  Voltage: 50B  [C0805]  (hidden comment: Capacitor)
C67  value 0,1мк  Voltage: 50B  [C0603]  (hidden comment: Capacitor)
C68  value 0,1мк  Voltage: 50B  [C0603]  (hidden comment: Capacitor)
C69  value 1мк  Voltage: 50B  [C0805]  (hidden comment: Capacitor)
C70  value 1мк  Voltage: 50B  [C0805]  (hidden comment: Capacitor)
C71  value 0,1мк  Voltage: 50B  [C0603]  (hidden comment: Capacitor)
C72  value 0,1мк  Voltage: 50B  [C0603]  (hidden comment: Capacitor)
C73  value 1мк  Voltage: 50B  [C0805]  (hidden comment: Capacitor)
C74  value 1мк  Voltage: 50B  [C0805]  (hidden comment: Capacitor)
C75  value 0,1мк  Voltage: 50B  [C0603]  (hidden comment: Capacitor)
DA6  OPA137PA  [DIP8]
DA7  MPXV5050GP  [SOP8]
DA8  OPA137PA  [DIP8]
DA9  MPXV5050GP  [SOP8]
DA10  OPA137PA  [DIP8]
DA11  MPXV5050GP  [SOP8]
DA12  OPA137PA  [DIP8]
DA13  MPXV5050GP  [SOP8]
R45  value 1к  [R0603]  (hidden comment: Resistor_0,062Вт)
R46  value 1к  [R0603]  (hidden comment: Resistor_0,062Вт)
R47  value 1к  [R0603]  (hidden comment: Resistor_0,062Вт)
R48  value 1к  [R0603]  (hidden comment: Resistor_0,062Вт)
R49  value 1м  [R0603]  (hidden comment: Resistor_0,062Вт)
R50  value 1к  [R0603]  (hidden comment: Resistor_0,062Вт)
R51  value 1к  [R0603]  (hidden comment: Resistor_0,062Вт)
R52  value 1к  [R0603]  (hidden comment: Resistor_0,062Вт)
R53  value 1к  [R0603]  (hidden comment: Resistor_0,062Вт)
R54  value 1к  [R0603]  (hidden comment: Resistor_0,062Вт)
R55  value 1м  [R0603]  (hidden comment: Resistor_0,062Вт)
R56  value 1к  [R0603]  (hidden comment: Resistor_0,062Вт)
R57  value 1к  [R0603]  (hidden comment: Resistor_0,062Вт)
R58  value 1к  [R0603]  (hidden comment: Resistor_0,062Вт)
R59  value 1к  [R0603]  (hidden comment: Resistor_0,062Вт)
R60  value 1к  [R0603]  (hidden comment: Resistor_0,062Вт)
R61  value 1м  [R0603]  (hidden comment: Resistor_0,062Вт)
R62  value 1к  [R0603]  (hidden comment: Resistor_0,062Вт)
R63  value 1к  [R0603]  (hidden comment: Resistor_0,062Вт)
R64  value 1к  [R0603]  (hidden comment: Resistor_0,062Вт)
R65  value 1к  [R0603]  (hidden comment: Resistor_0,062Вт)
R66  value 1к  [R0603]  (hidden comment: Resistor_0,062Вт)
R67  value 1м  [R0603]  (hidden comment: Resistor_0,062Вт)
R68  value 1к  [R0603]  (hidden comment: Resistor_0,062Вт)

### Nets
5BA: C46.2 C47.2 C50.2 C51.2 C52.2 C54.2 C57.2 C58.2 C64.2 C65.2 C66.2 C67.2 C70.2 C72.2 C74.2 C75.2 DA6.7(V+) DA7.2(VS) DA8.7(V+) DA9.2(VS) DA10.7(V+) DA11.2(VS) DA12.7(V+) DA13.2(VS) R46.2 R52.2 R58.2 R64.2
AGND: C41.2 C44.2 C46.1 C47.1 C48.2 C50.1 C51.1 C52.1 C53.2 C54.1 C57.1 C58.1 C59.2 C62.2 C64.1 C65.1 C66.1 C67.1 C68.2 C70.1 C71.2 C72.1 C74.1 C75.1 DA6.4(V-) DA7.3(GND) DA8.4(V-) DA9.3(GND) DA10.4(V-) DA11.3(GND) DA12.4(V-) DA13.3(GND) R45.1 R51.1 R57.1 R63.1
MCU_SENSOR_1: C40.2 DA6.6(Output) R47.1
MCU_SENSOR_2: C56.2 DA10.6(Output) R59.1
MCU_SENSOR_3: C43.2 DA8.6(Output) R53.1
MCU_SENSOR_4: C61.2 DA12.6(Output) R65.1
NetC40_1: C40.1 DA6.2(IN-) R47.2 R48.1
NetC41_1: C41.1 C42.2 R45.2 R46.1 R49.2
NetC42_1: C42.1 R48.2
NetC43_1: C43.1 DA8.2(IN-) R53.2 R54.1
NetC44_1: C44.1 C45.2 R50.1
NetC45_1: C45.1 DA6.3(IN+) R49.1
NetC48_1: C48.1 C49.2 R51.2 R52.1 R55.2
NetC49_1: C49.1 R54.2
NetC53_1: C53.1 C55.2 R56.1
NetC55_1: C55.1 DA8.3(IN+) R55.1
NetC56_1: C56.1 DA10.2(IN-) R59.2 R60.1
NetC59_1: C59.1 C60.2 R57.2 R58.1 R61.2
NetC60_1: C60.1 R60.2
NetC61_1: C61.1 DA12.2(IN-) R65.2 R66.1
NetC62_1: C62.1 C63.2 R62.1
NetC63_1: C63.1 DA10.3(IN+) R61.1
NetC68_1: C68.1 C69.2 R63.2 R64.1 R67.2
NetC69_1: C69.1 R66.2
NetC71_1: C71.1 C73.2 R68.1
NetC73_1: C73.1 DA12.3(IN+) R67.1
NetDA7_4: DA7.4(VOUT) R50.2
NetDA9_4: DA9.4(VOUT) R56.2
NetDA11_4: DA11.4(VOUT) R62.2
NetDA13_4: DA13.4(VOUT) R68.2

Not connected (* = marked no-connect by the designer): DA6 1(NC) 5(NC) 8(NC); DA7 1(NC_1)* 5(NC_2)* 6(NC_3)* 7(NC_4)* 8(NC_5)*; DA8 1(NC) 5(NC) 8(NC); DA9 1(NC_1)* 5(NC_2)* 6(NC_3)* 7(NC_4)* 8(NC_5)*; DA10 1(NC) 5(NC) 8(NC); DA11 1(NC_1)* 5(NC_2)* 6(NC_3)* 7(NC_4)* 8(NC_5)*; DA12 1(NC) 5(NC) 8(NC); DA13 1(NC_1)* 5(NC_2)* 6(NC_3)* 7(NC_4)* 8(NC_5)*

### Notes on the sheet
- Подп. и дата
- Инв. № дубл.
- Взам. инв. №
- Инв. № подл.
- Лист
- Изм.
- № докум.
- Подп.
- Дата
- Копировал
- Формат

### Library data of the parts
C40 C43 C56 C61 = cap71: Конденсатор; Part Name: Ceramic; Manufacture: Murata; Part Number: GRM1885C1H100J; id: cap71; TKE: NP0
C41 C44 C47 C48 C51 C53 C54 C58 C59 C62 C65 C67 C68 C71 C72 C75 = cap131: as C1 on sheet CutMonitor_Opto
C42 C45 C46 C49 C50 C52 C55 C57 C60 C63 C64 C66 C69 C70 C73 C74 = cap151: as C22 on sheet CutMonitor_Motor
DA6 DA8 DA10 DA12 = amp11: FET-INPUT OPERATIONAL AMPLIFIERS; Part Name: FET-INPUT Amplifier; Manufacture: Texas Instruments; id: amp11; Rail-to-rail: yes; Supply Voltage: 4,5-36B; Bandwidth: 1МГц; Input Bias Current: 100pA; CMRR: 76-84dB; PSRR: 80,92dB; Offset voltage: 2,5mB; Channels: 1; Part Number: OPA137PA
DA7 DA9 DA11 DA13 = MPXV5050GP: Integrated Silicon Pressure Sensor; Manufacture: Freescale Semiconductor; id: sensor4; Interface: ANALOG; Part Number: MPXV5050GP; Part Name: Integrated Silicon Pressure Sensor; Type sensor: Pressure
R45-R48 R50-R54 R56-R60 R62-R66 R68 = res459: as R3 on sheet CutMonitor_Opto; Part Name: Resistor; Power: 0,062Вт
R49 R55 R61 R67 = res531: Резистор; Manufacture: Yageo; Part Number: RC0603FR-071ML; id: res531; Accuracy: 0,01; Part Name: Resistor; Power: 0,062Вт

## Nets that join several sheets
3,3B: CutMonitor_MCU (18 pins), CutMonitor_Power (C36.1 DA4.3 VD6.2)
5BA: CutMonitor_Power (R43.2), CutMonitor_PressureSensor (28 pins)
5В: CutMonitor_Opto (DD1.1), CutMonitor_Motor (10 pins)
12B: CutMonitor_Power (11 pins), CutMonitor_Motor (8 pins)
AGND: CutMonitor_Power (R44.2), CutMonitor_PressureSensor (36 pins)
DGND: CutMonitor_Opto (12 pins), CutMonitor_MCU (24 pins), CutMonitor_Power (C36.2 C37.1 DA4.2 DA4.4)
PGND: CutMonitor_Opto (DD1.2), CutMonitor_Power (16 pins)
MCU_OPTO_OUT1: CutMonitor_Opto (R4.2 VT1.2), CutMonitor_MCU (DD2.41)
MCU_OPTO_OUT2: CutMonitor_Opto (R12.2 VT2.2), CutMonitor_MCU (DD2.42)
MCU_OPTO_OUT3: CutMonitor_Opto (R22.2 VT3.2), CutMonitor_MCU (DD2.43)
MCU_OPTO_OUT4: CutMonitor_Opto (R28.2 VT4.2), CutMonitor_MCU (DD2.45)
MCU_SENSOR_1: CutMonitor_MCU (DD2.21), CutMonitor_PressureSensor (C40.2 DA6.6 R47.1)
MCU_SENSOR_2: CutMonitor_MCU (DD2.22), CutMonitor_PressureSensor (C56.2 DA10.6 R59.1)
MCU_SENSOR_3: CutMonitor_MCU (DD2.25), CutMonitor_PressureSensor (C43.2 DA8.6 R53.1)
MCU_SENSOR_4: CutMonitor_MCU (DD2.26), CutMonitor_PressureSensor (C61.2 DA12.6 R65.1)
MOTOR_OUT1: CutMonitor_MCU (DD2.11), CutMonitor_Motor (DA2.2)
MOTOR_OUT2: CutMonitor_MCU (DD2.12), CutMonitor_Motor (DA2.4)
MOTOR_OUT3: CutMonitor_MCU (DD2.13), CutMonitor_Motor (DA3.2)
MOTOR_OUT4: CutMonitor_MCU (DD2.14), CutMonitor_Motor (DA3.4)